# EAGLE schematic Galvanometer (EAGLE 9.6.2)
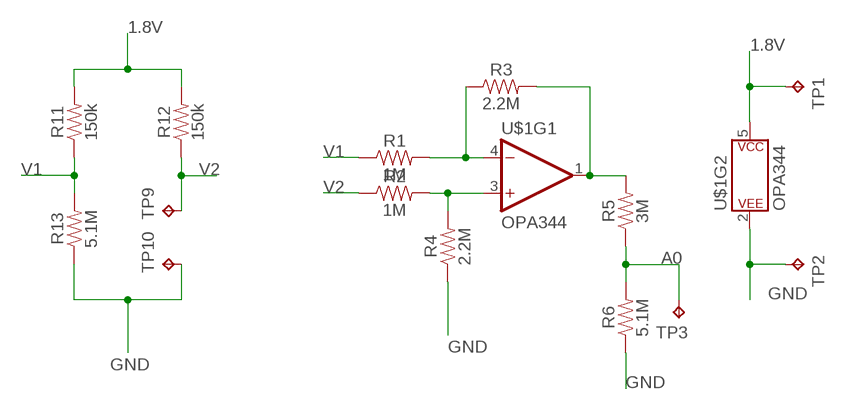
[diagram p0: schematic, sheet 1]

## Parts
R1  1M  RESISTOR0603  [0603]
R2  1M  RESISTOR0603  [0603]
R3  2.2M  RESISTOR0603  [0603]
R4  2.2M  RESISTOR0603  [0603]
R5  3M  RESISTOR0603  [0603]
R6  5.1M  RESISTOR0603  [0603]
R11  150k  10KOHM-0603-1/10W-1%  [0603]
R12  150k  10KOHM-0603-1/10W-1%  [0603]
R13  5.1M  10KOHM-0603-1/10W-1%  [0603]
TP1  TPTP19R  [TP19R]
TP2  TPTP19R  [TP19R]
TP3  TPTP19R  [TP19R]
TP9  TPTP19R  [TP19R]
TP10  TPTP19R  [TP19R]
U$1  OPA344  [SOT23-5]

## Nets
1.8V: R11.2 R12.2 TP1.TP U$1.5(P$V+)
A0: R5.1 R6.2 TP3.TP
GND: R4.1 R6.1 R13.1 TP2.TP TP10.TP U$1.2(P$V-)
N$2: R1.2 R3.1 U$1.4(-IN)
N$10: R2.2 R4.2 U$1.3(+IN)
N$12: R3.2 R5.2 U$1.1(OUT)
V1: R1.1 R11.1 R13.2
V2: R2.1 R12.1 TP9.TP

## Library data of the parts
R1-R6 = SparkFun-Resistors:RESISTOR: Generic Resistor Package
R11-R13 = SparkFun-Resistors:10KOHM: 10kΩ resistor A resistor is a passive two-terminal electrical component that implements electrical resistance as a circuit element. Resistors act to reduce current flow, and, at the same time, act to lower voltage levels within circuits. - Wikipedia; PROD_ID: RES-00824; VALUE: 10k
TP1-TP3 TP9 TP10 = testpad:TP: Test pad
U$1 = SparkFun-IC-Amplifiers:OPA344: Single gate rail-to-rail output op-amp. Inputs extend 300mV past rails. Datasheet <http://www.ti.com/product/OPA344> SparkFun Products SparkFun Low Current Sensor <https://www.sparkfun.com/products/8883> (SEN-08883) SparkFun Electret Microphone Breakout <https://www.sparkfun.com/products/12758> (BOB-12758); PROD_ID: IC-08251